# EAGLE design weather-sensor (EAGLE 9.6.1)
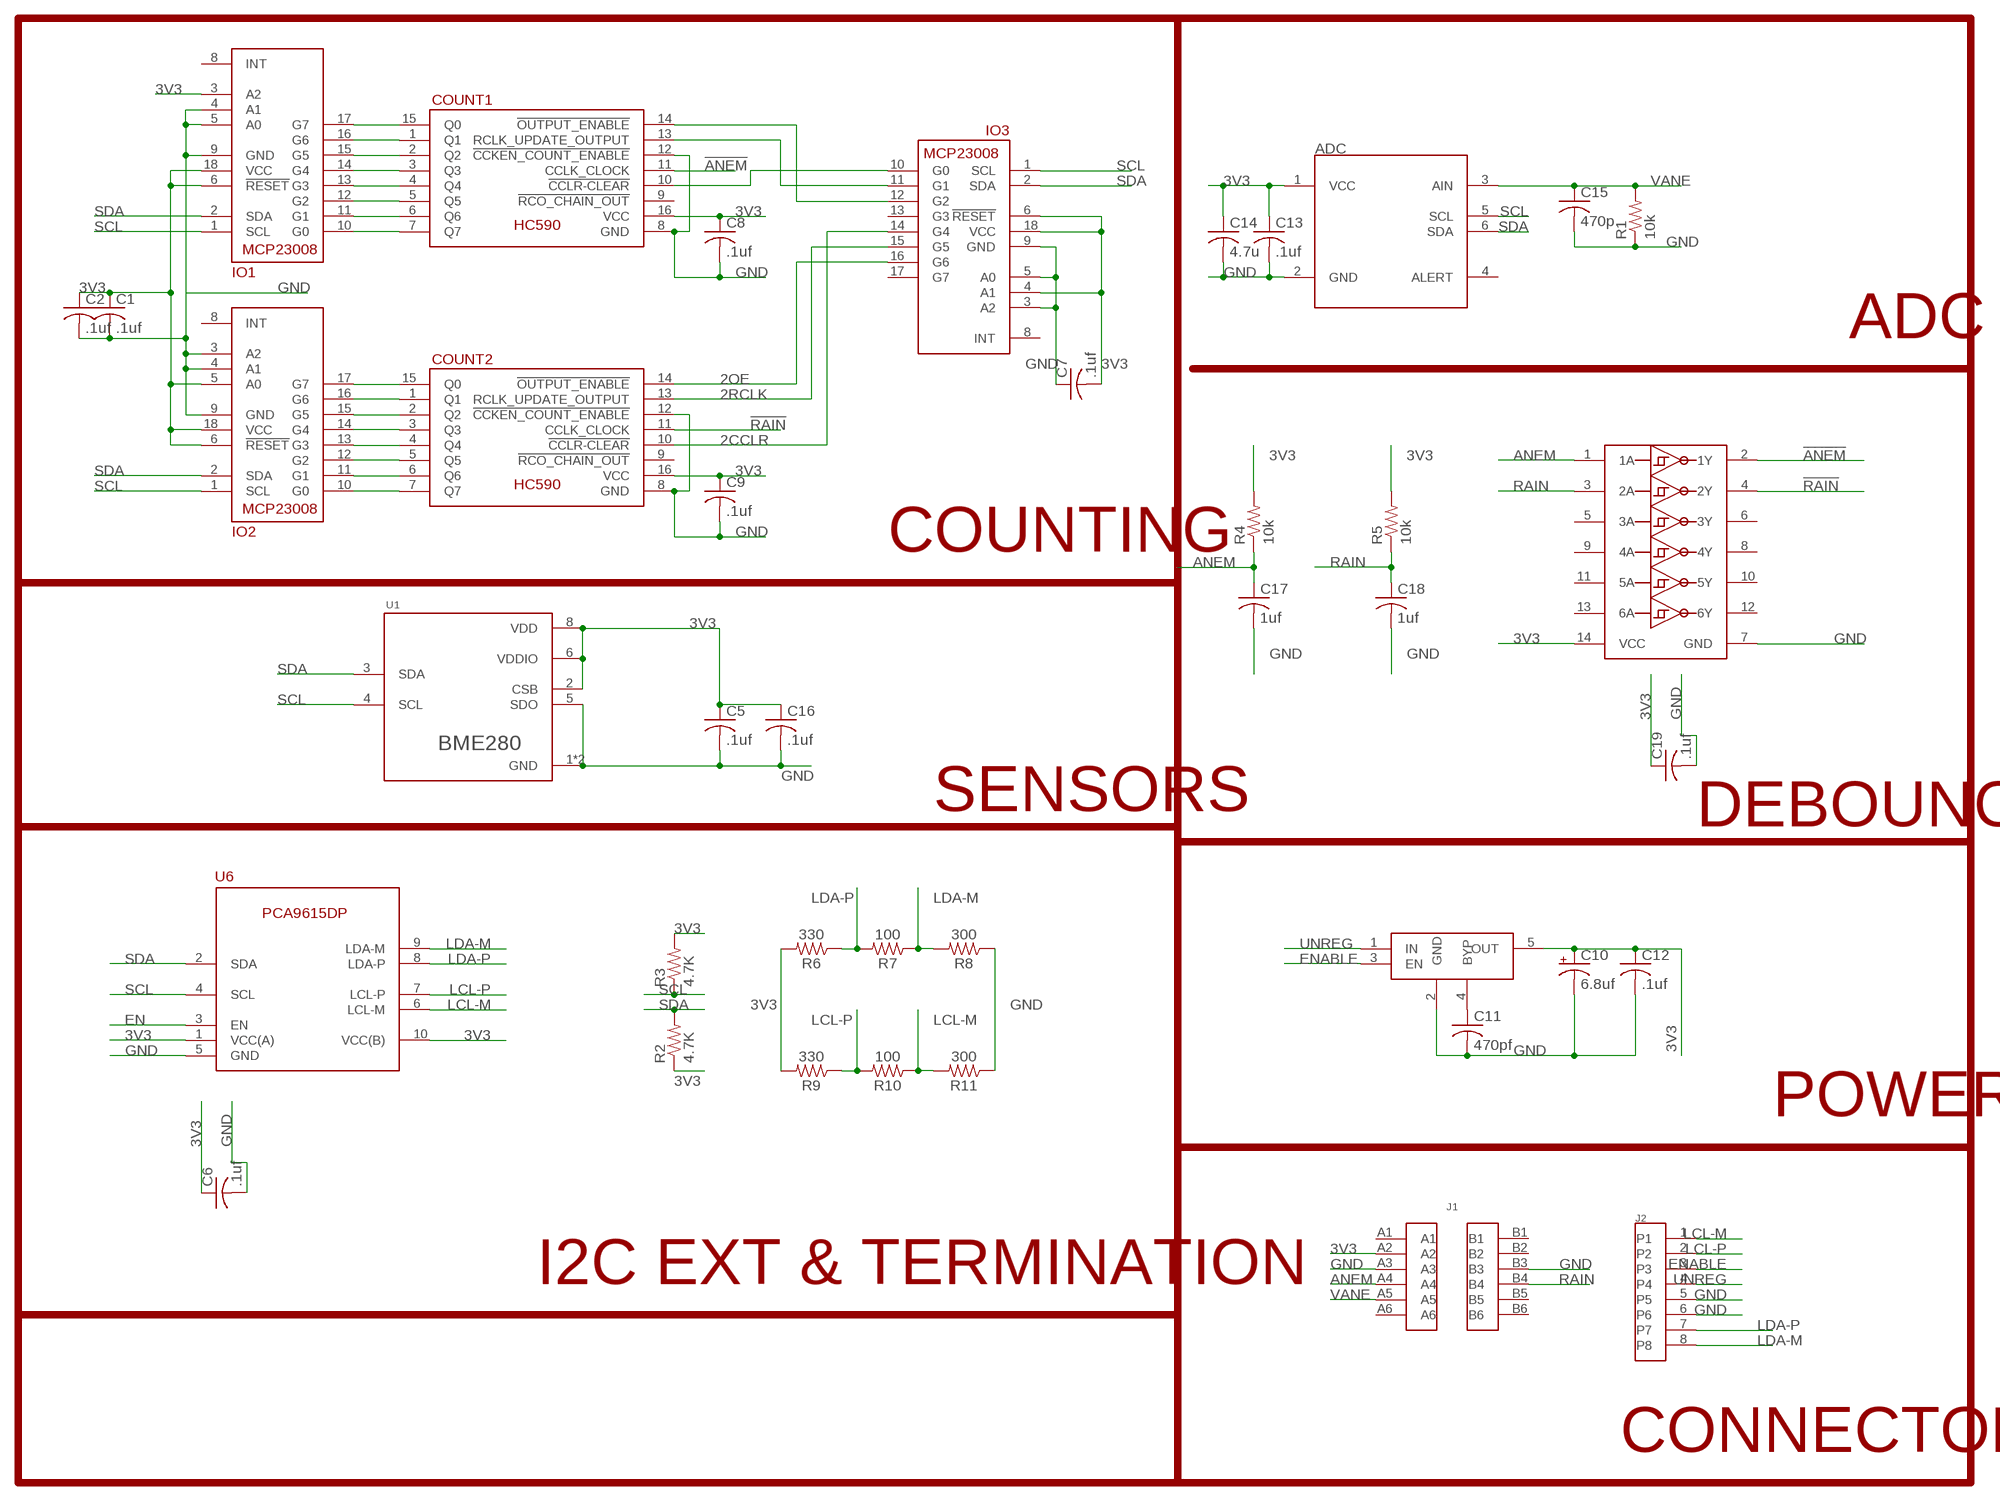
[diagram p0: schematic, sheet 1]

## Parts
ADC  ADC081C021SOT-DDC  [SOP95P280X110-6]
C1  .1uf  C-USC0603K  [C0603K]
C2  .1uf  C-USC0603K  [C0603K]
C5  .1uf  C-USC0603K  [C0603K]
C6  .1uf  C-USC0603K  [C0603K]
C7  .1uf  C-USC0603K  [C0603K]
C8  .1uf  C-USC0603K  [C0603K]
C9  .1uf  C-USC0603K  [C0603K]
C10  6.8uf  CPOL-USA/3216-18R  [A/3216-18R]
C11  470pf  C-USC0603K  [C0603K]
C12  .1uf  C-USC0603K  [C0603K]
C13  .1uf  C-USC0603K  [C0603K]
C14  4.7u  C-USC0603K  [C0603K]
C15  470p  C-USC0603K  [C0603K]
C16  .1uf  C-USC0603K  [C0603K]
C17  1uf  C-USC0603K  [C0603K]
C18  1uf  C-USC0603K  [C0603K]
C19  .1uf  C-USC0603K  [C0603K]
COUNT1  74HC590  [SOIC127P1050X265-16]
COUNT2  74HC590  [SOIC127P1050X265-16]
INVERTER  74HC14  [SOIC127P780X200-14]
IO1  MCP23008  [SOIC18-W]
IO2  MCP23008  [SOIC18-W]
IO3  MCP23008  [SOIC18-W]
J1  43841-0005  [43841-0005]
J2  95501-6889  [95501-6889]
R1  10k  R-US_R0603  [R0603]
R2  4.7K  R-US_R0603  [R0603]
R3  4.7K  R-US_R0603  [R0603]
R4  10k  R-US_R0603  [R0603]
R5  10k  R-US_R0603  [R0603]
R6  330  100KOHM-0603-1/10W-1%  [0603]
R7  100  100KOHM-0603-1/10W-1%  [0603]
R8  300  100KOHM-0603-1/10W-1%  [0603]
R9  330  100KOHM-0603-1/10W-1%  [0603]
R10  100  100KOHM-0603-1/10W-1%  [0603]
R11  300  100KOHM-0603-1/10W-1%  [0603]
U1  BME280  [BM280]
U5  MIC5219-3.3YM5-TR  [SOT95P280X145-5]
U6  PCA9615  [SOP50P490X110-10]

## Nets
2CCLR: COUNT2.10(!CCLR-CLEAR) IO3.14(G4)
2OE: COUNT2.14(!OUTPUT_ENABLE) IO3.16(G6)
2RCLK: COUNT2.13(RCLK_UPDATE_OUTPUT) IO3.15(G5)
3V3: ADC.1(VCC) C1.1 C2.1 C5.1 C6.1 C7.2 C8.1 C9.1 C10.+ C12.1 C13.1 C14.1 C16.1 C19.1 COUNT1.16(VCC) COUNT2.16(VCC) INVERTER.14(VCC) IO1.3(A2) IO1.6(!RESET) IO1.18(VCC) IO2.5(A0) IO2.6(!RESET) IO2.18(VCC) IO3.4(A1) IO3.6(!RESET) IO3.18(VCC) J1.A2 R2.1 R3.2 R4.2 R5.2 R6.2 R9.2 U1.2(CSB) U1.6(VDDIO) U1.8(VDD) U5.5(OUT) U6.1(VCC(A)) U6.10(VCC(B))
!ANEM: COUNT1.11(CCLK_CLOCK) INVERTER.2(1Y)
!RAIN: COUNT2.11(CCLK_CLOCK) INVERTER.4(2Y)
ANEM: C17.1 INVERTER.1(1A) J1.A4 R4.1
EN: U6.3(EN)
ENABLE: J2.3 U5.3(EN)
GND: ADC.2(GND) C1.2 C2.2 C5.2 C6.2 C7.1 C8.2 C9.2 C10.- C11.2 C12.2 C13.2 C14.2 C15.2 C16.2 C17.2 C18.2 C19.2 COUNT1.8(GND) COUNT1.12(!CCKEN_COUNT_ENABLE) COUNT2.8(GND) COUNT2.12(!CCKEN_COUNT_ENABLE) INVERTER.7(GND) IO1.4(A1) IO1.5(A0) IO1.9(GND) IO2.3(A2) IO2.4(A1) IO2.9(GND) IO3.3(A2) IO3.5(A0) IO3.9(GND) J1.A3 J1.B3 J2.5 J2.6 R1.1 R8.1 R11.1 U1.1(GND) U1.5(SDO) U1.7(GND) U5.2(GND) U6.5(GND)
LCL-M: J2.1 R10.1 R11.2 U6.6(LCL-M)
LCL-P: J2.2 R9.1 R10.2 U6.7(LCL-P)
LDA-M: J2.8 R7.1 R8.2 U6.9(LDA-M)
LDA-P: J2.7 R6.1 R7.2 U6.8(LDA-P)
N$1: COUNT2.15(Q0) IO2.17(G7)
N$2: COUNT2.1(Q1) IO2.16(G6)
N$3: COUNT2.2(Q2) IO2.15(G5)
N$4: COUNT2.3(Q3) IO2.14(G4)
N$5: COUNT2.4(Q4) IO2.13(G3)
N$6: COUNT2.5(Q5) IO2.12(G2)
N$7: COUNT2.6(Q6) IO2.11(G1)
N$8: COUNT2.7(Q7) IO2.10(G0)
N$9: COUNT1.15(Q0) IO1.17(G7)
N$10: COUNT1.1(Q1) IO1.16(G6)
N$12: COUNT1.2(Q2) IO1.15(G5)
N$13: COUNT1.3(Q3) IO1.14(G4)
N$14: COUNT1.4(Q4) IO1.13(G3)
N$15: COUNT1.5(Q5) IO1.12(G2)
N$16: COUNT1.6(Q6) IO1.11(G1)
N$17: COUNT1.7(Q7) IO1.10(G0)
N$18: COUNT1.14(!OUTPUT_ENABLE) IO3.12(G2)
N$19: COUNT1.13(RCLK_UPDATE_OUTPUT) IO3.11(G1)
N$20: COUNT1.10(!CCLR-CLEAR) IO3.10(G0)
N$23: C11.1 U5.4(BYP)
RAIN: C18.1 INVERTER.3(2A) J1.B4 R5.1
SCL: ADC.5(SCL) IO1.1(SCL) IO2.1(SCL) IO3.1(SCL) R3.1 U1.4(SCL) U6.4(SCL)
SDA: ADC.6(SDA) IO1.2(SDA) IO2.2(SDA) IO3.2(SDA) R2.2 U1.3(SDA) U6.2(SDA)
UNREG: J2.4 U5.1(IN)
VANE: ADC.3(AIN) C15.1 J1.A5 R1.2
Unconnected: ADC.4(ALERT) COUNT1.9(!RCO_CHAIN_OUT) COUNT2.9(!RCO_CHAIN_OUT) INVERTER.5(3A) INVERTER.6(3Y) INVERTER.8(4Y) INVERTER.9(4A) INVERTER.10(5Y) INVERTER.11(5A) INVERTER.12(6Y) INVERTER.13(6A) IO1.8(INT) IO2.8(INT) IO3.8(INT) IO3.13(G3) IO3.17(G7) J1.A1 J1.A6 J1.B1 J1.B2 J1.B5 J1.B6

## Notes on the sheet
- ADC
- COUNTING
- SENSORS | DEBOUNCE
- POWER
- I2C EXT & TERMINATION
- CONNECTORS

## Library data of the parts
ADC = Conservify:ADC081C021: 8-Bit ADC with Altert
C1 C2 C5-C9 C11-C19 = rcl:C-US: CAPACITOR, American symbol; SPICEPREFIX: C
C10 = rcl:CPOL-US: POLARIZED CAPACITOR, American symbol; SPICEPREFIX: C
COUNT1 COUNT2 = Conservify:74HC590
INVERTER = Conservify:74HC14
IO1-IO3 = Conservify:MCP23008
J1 = Conservify:43841-0005
J2 = Conservify:95501-6889: Molex RJ-45 Connector
R1-R5 = rcl:R-US_: RESISTOR, American symbol; SPICEPREFIX: R
R6-R11 = SparkFun-Resistors:100KOHM: 100kΩ resistor A resistor is a passive two-terminal electrical component that implements electrical resistance as a circuit element. Resistors act to reduce current flow, and, at the same time, act to lower voltage levels within circuits. - Wikipedia; PROD_ID: RES-07828; VALUE: 100k
U1 = Conservify:BME280
U5 = Conservify:MIC5219-3.3YM5-TR
U6 = Conservify:PCA9615

## Board
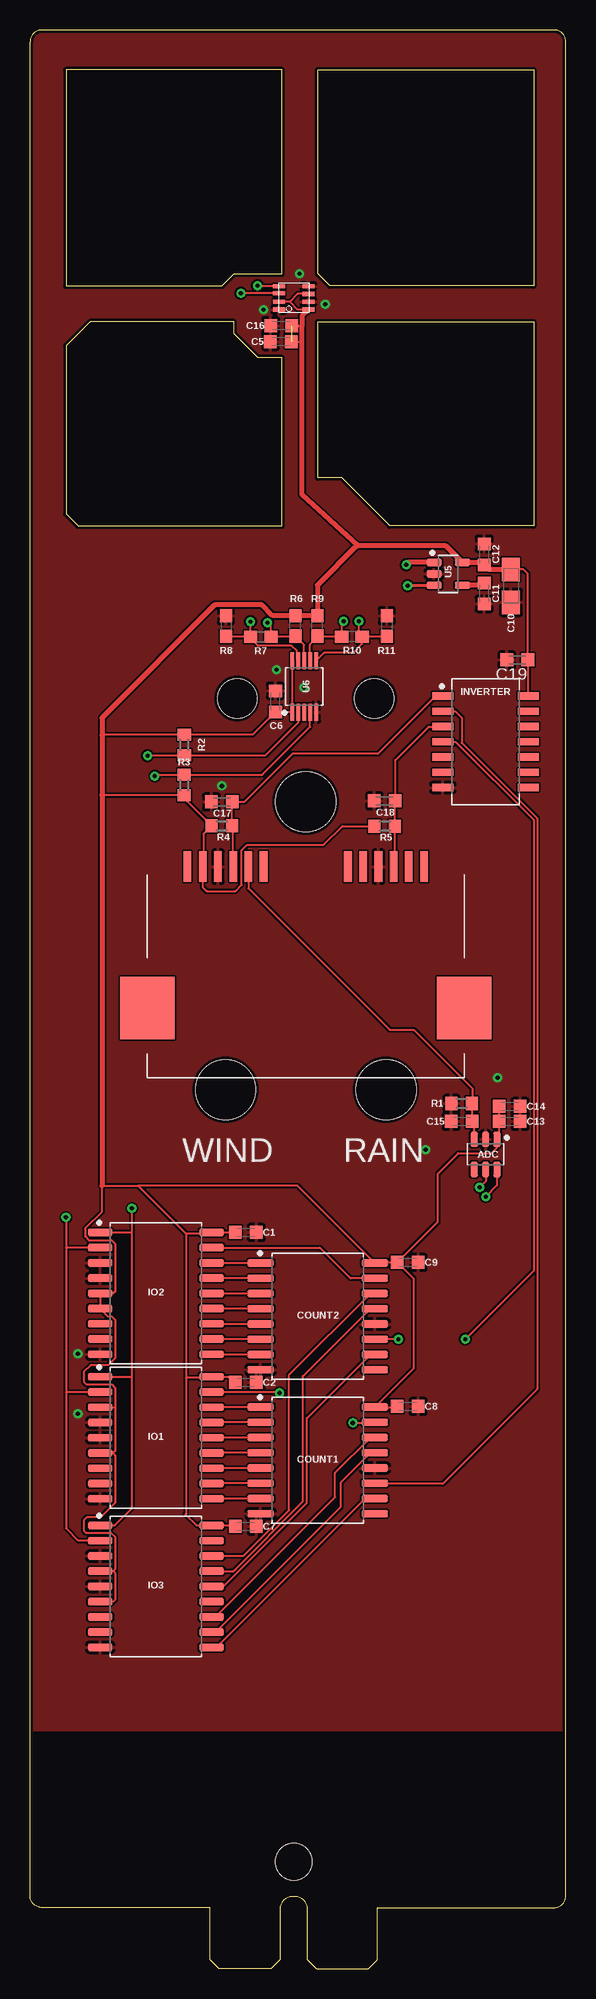
[diagram p1: board, top side]
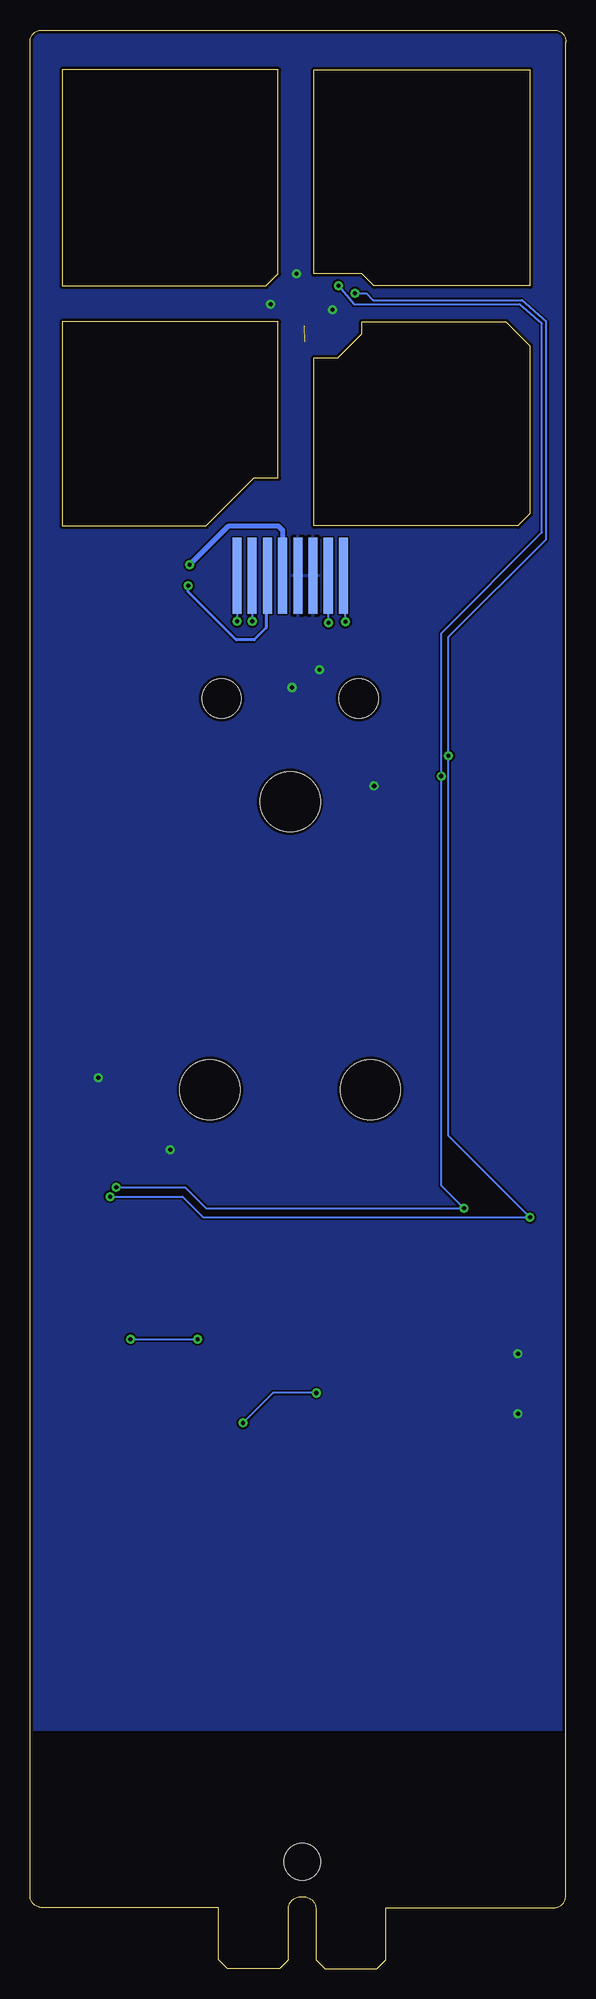
[diagram p2: board, bottom side, seen from below]

Size 44.7 x 161.54 mm. Coordinates in mm from the lower left corner, seen from the top.
Outline: 28.98,5.08 43.7,5.08 arc90 44.7,6.08 44.7,160.54 arc90 43.7,161.54 1,161.54 arc90 0,160.54 0,6.08 arc90 1,5.08 15.02,5.08 15.02,0.75 15.77,0 20.11,0 20.86,0.75 20.86,4.98 arc-90 21.86,5.98 22.14,5.98 arc-90 23.14,4.98 23.14,0.75 23.89,0 28.23,0 28.98,0.75 28.98,5.08
Outline: 24,137.22 42,137.22 42,120.22 30,120.22 26,124.22 24,124.22 24,137.22
Outline: 21,134.22 19,134.22 17,136.22 17,137.22 5,137.22 3,135.22 3,121.22 4,120.22 21,120.22 21,134.22
Outline: 17,141.22 21,141.22 21,158.22 3,158.22 3,140.22 16,140.22 17,141.22
Outline: 24,141.22 24,158.22 42,158.22 42,140.22 25,140.22 24,141.22
Copper layers (1*16): Top 0.035mm / dielectric 1.5mm / Bottom 0.035mm
Design rules "default *": minimum track width 6mil, minimum drill 0.35mm, track to track 6mil, track to pad 6mil, pad to pad 6mil, via to via 6mil, smd to smd 6mil, copper to edge 10mil, drill to drill 6mil, minimum pad ring 10mil, minimum via ring 8mil, stop-mask expansion 4mil, vias tented up to drill 0.35mm, thermal gap 10mil
Holes 5 mm at 23,97.22 16.3,73.22 29.7,73.22
Holes 3.05 mm at 22,8.89

### Footprints (pad centres in the part's own frame; a part is rotated, then mirrored left to right if it is on the bottom)
SOP95P280X110-6 = smd 1.25 x 0.602: 1 -1.256,0.95; 2 -1.256,0; 3 -1.256,-0.95; 4 1.256,-0.95; 5 1.256,0; 6 1.256,0.95
C0603K = smd 1.05 x 1.08: 1 -0.875,0; 2 0.875,0
A/3216-18R = smd 1.95 x 1.5: + 1.375,0; - -1.375,0
SOIC127P1050X265-16 = smd 2.187 x 0.602: 1 -4.76,4.445; 2 -4.76,3.175; 3 -4.76,1.905; 4 -4.76,0.635; 5 -4.76,-0.635; 6 -4.76,-1.905; 7 -4.76,-3.175; 8 -4.76,-4.445; 9 4.76,-4.445; 10 4.76,-3.175; 11 4.76,-1.905; 12 4.76,-0.635; 13 4.76,0.635; 14 4.76,1.905; 15 4.76,3.175; 16 4.76,4.445
SOIC127P780X200-14 = smd 1.774 x 0.605: 1 -3.567,3.81; 2 -3.567,2.54; 3 -3.567,1.27; 4 -3.567,0; 5 -3.567,-1.27; 6 -3.567,-2.54; 7 -3.567,-3.81; 8 3.567,-3.81; 9 3.567,-2.54; 10 3.567,-1.27; 11 3.567,0; 12 3.567,1.27; 13 3.567,2.54; 14 3.567,3.81
SOIC18-W = smd 2.052 x 0.602: 1 -4.654,5.08; 2 -4.654,3.81; 3 -4.654,2.54; 4 -4.654,1.27; 5 -4.654,0; 6 -4.654,-1.27; 7 -4.654,-2.54; 8 -4.654,-3.81; 9 -4.654,-5.08; 10 4.654,-5.08; 11 4.654,-3.81; 12 4.654,-2.54; 13 4.654,-1.27; 14 4.654,0; 15 4.654,1.27; 16 4.654,2.54; 17 4.654,3.81; 18 4.654,5.08
43841-0005 = smd 0.63 x 2.54: A1 -9.87,17.58; A2 -8.6,17.58; A3 -7.33,17.58; A4 -6.06,17.58; A5 -4.79,17.58; A6 -3.52,17.58; B1 3.52,17.58; B2 4.79,17.58; B3 6.06,17.58; B4 7.33,17.58; B5 8.6,17.58; B6 9.87,17.58 | smd 4.52 x 5.21: PAD1 -13.21,5.785; PAD2 13.21,5.785
95501-6889 = smd 0.76 x 6.35: 1 -4.445,10.225; 2 -3.175,10.225; 3 -1.905,10.225; 4 -0.635,10.225; 5 0.635,10.225; 6 1.905,10.225; 7 3.175,10.225; 8 4.445,10.225 | hole 3.25: -5.715,0; 5.715,0
R0603 = smd 1 x 1.1: 1 -0.85,0; 2 0.85,0
0603 = smd 1.1 x 1: 1 -0.85,0; 2 0.85,0
BM280 = smd 1 x 0.35: 1 1.225,0.975; 2 1.225,0.325; 3 1.225,-0.375; 4 1.225,-0.975; 5 -1.225,-0.975; 6 -1.225,-0.325; 7 -1.225,0.325; 8 -1.225,0.975
SOT95P280X145-5 = smd 1.262 x 0.609: 1 -1.175,0.95; 2 -1.175,0; 3 -1.175,-0.95; 4 1.175,-0.95; 5 1.175,0.95
SOP50P490X110-10 = smd 1.438 x 0.297: 1 -2.145,1; 2 -2.145,0.5; 3 -2.145,0; 4 -2.145,-0.5; 5 -2.145,-1; 6 2.145,-1; 7 2.145,-0.5; 8 2.145,0; 9 2.145,0.5; 10 2.145,1

### Placement (x,y rotation side)
ADC  38,67.84 270 top
C1  18,61.34 0 top
C2  18,48.84 0 top
C5  20.92,135.58 180 top
C6  20.46,105.59 90 top
C7  18,36.84 180 top
C8  31.5,46.84 0 top
C9  31.5,58.84 0 top
C10  40.12,115.22 90 top
C11  37.88,114.6 270 top
C12  37.88,117.85 90 top
C13  40,70.59 0 top
C14  40,71.84 0 top
C15  36,70.59 180 top
C16  20.95,136.91 180 top
C17  16,97.22 180 top
C18  29.59,97.3 180 top
C19  40.65,109.06 180 top
COUNT1  24,42.34 0 top
COUNT2  24,54.34 0 top
INVERTER  38,102.22 0 top
IO1  10.5,44.23 0 top
IO2  10.5,56.27 0 top
IO3  10.5,31.84 0 top
J1  23,74.24 0 top
J2  23,105.83 0 bottom
R1  36,72.09 0 top
R2  12.87,101.97 270 top
R3  12.86,98.61 270 top
R4  16,95.22 180 top
R5  29.59,95.2 180 top
R6  22.13,111.89 90 top
R7  19.25,110.97 0 top
R8  16.35,111.88 270 top
R9  23.97,111.89 90 top
R10  26.86,111 180 top
R11  29.75,111.88 270 top
U1  22,139.22 180 top
U5  34.88,116.22 0 top
U6  22.87,106.84 90 top

### Tracks (layer width: path | path; a pad name or v marks a point on that pad's centre or on a via)
2CCLR
  Top 0.152: COUNT2.10 28.38,51.17 23.09,45.88 23.09,38.81 16.12,31.84 IO3.14
2OE
  Top 0.152: COUNT2.14 28.38,56.25 21.62,49.48 21.62,38.2 17.8,34.38 IO3.16
2RCLK
  Top 0.152: COUNT2.13 28.38,54.98 22.77,49.37 22.77,38.92 16.96,33.11 IO3.15
3V3  (1 unrouted)
  Top 0.152: 6,102.74 6.08,102.82 R2.1 18.57,102.82 C6.1 20.48,104.7 U6.1 U6.10 | 6,97.79 6.03,97.76 R3.2 12.86,97.51 R4.2 14.48,94.55 14.48,91.9 J1.A2 14.4,90.12 14.73,89.79 17.14,89.79 17.67,90.31 17.67,93.19 18.11,93.63 24.49,93.63 26.06,95.2 R5.2 29.08,94.86 | 7.1,46.74 7.1,48.37 6.8,48.67 4.71,48.67 4.49,48.89 4.49,49.74 5.05,50.29 6.53,50.29 7.1,50.86 7.1,54.05 6.8,54.36 6.49,54.36 IO2.6 IO2.5 6.96,56.27 7.1,56.41 7.1,60.4 6.8,60.7 4.91,60.7 4.59,61.02 4.59,61.67 6,63.08 6,65.22 9,65.22 | 7.1,46.74 7.1,43.11 6.96,42.96 IO1.6 6.91,42.96 7.1,42.77 7.1,38.83 5.88,37.6 4.75,37.6 4.49,37.35 4.49,36.5 4.66,36.33 6.75,36.33 7.1,35.98 7.1,33.26 6.96,33.11 | 6.96,33.11 IO3.4 | 6.96,33.11 7.1,32.97 7.1,30.72 6.96,30.57 IO3.6 | 9,65.22 13,61.22 | 13,61.22 13,49.22 | 13,49.22 13,37.89 12.95,37.85 13.88,36.92 IO3.18 17.05,36.92 C7.2 | 13,49.22 15.06,49.22 IO1.18 16.66,49.31 C2.1 | 13,61.22 15.03,61.22 IO2.18 C1.1 | C9.1 28.82,58.84 COUNT2.16 22.32,65.22 9,65.22 | C8.1 30.57,46.79 COUNT1.16 32,50.03 32,57.47 C9.1 | C9.1 34,62.22 34,66.22 35.72,67.94 38.48,67.94 38.95,68.41 ADC.1 39.12,69.28 C13.1 C14.1 | INVERTER.14 41.57,109.01 C19.1 41.52,116.21 41.13,116.6 40,116.6 | IO1.3 7.06,46.77 7.1,46.74 | U1.6 22.33,139.55 21.68,138.9 | 21.68,138.9 U1.2 | U1.8 22.33,138.25 21.68,138.9 | C16.1 22.7,136.91 | C5.1 22.64,135.58
  Top 0.406: C10.+ 40,116.6 38.26,116.6 C12.1 37.68,117.17 U5.5 34.68,118.55 27.34,118.55 | 27.34,118.55 27.23,118.55 23.97,115.29 R9.2 R6.2 20.25,112.74 19.35,113.64 15.41,113.64 6,104.22 6,102.74 6,97.79 6,65.22 | 27.34,118.55 22.7,122.84 22.7,136.91 22.7,137.73 U1.8
!ANEM
  Top 0.152: INVERTER.2 35.46,104.76 36,104.22 36,102.15 42.3,95.84 42.3,48.27 34.42,40.39 28.81,40.39 COUNT1.11
!RAIN  (via drill 0.35)
  Top 0.152: INVERTER.4 35.49,102.22 42,95.72 42,58.13 v36.32,52.45 | v30.73,52.45 30.72,52.44 COUNT2.11
  Bottom 0.152: v36.32,52.45 v30.73,52.45
ANEM
  Top 0.152: J1.A4 16.94,95.13 R4.1 16.85,97.2 C17.1 17.88,97.22 21.88,101.22 29,101.22 34,106.22 34.24,106.22 INVERTER.1
ENABLE  (via drill 0.35)
  Top 0.254: v31.5,115.22 31.55,115.27 U5.3
  Bottom 0.254: J2.3 25,115.96 25,111.72 26,110.72 27.5,110.72 31.5,114.72 v31.5,115.22
GND  (via drill 0.35)
  other vias: 4,51.22 4,46.22 39,74.22 33,68.22 16,98.55 22.86,106.75 20.56,108.23 22.48,141.22 19.48,138.22 24.62,138.68
  pour Top: -0.5,162.69 -0.5,19.84 45,19.84 45,162.69
  pour Bottom: -0.5,162.69 -0.5,19.84 45,19.84 45,162.69
LCL-M  (via drill 0.35)
  Top 0.152: R10.1 29.71,111 R11.2 | R10.1 27.43,111.27 v27.43,112.27 | U6.6 24.56,109.67 27,109.67 27.71,110.38 R10.1
  Bottom 0.152: J2.1 27.45,112.28 v27.43,112.27
LCL-P  (via drill 0.35)
  Top 0.152: 24.02,111 R10.2 26.01,112.11 v26.16,112.27 | 24.02,111 R9.1 | U6.7 23.37,110.36 24.02,111
  Bottom 0.152: v26.16,112.27 26.16,116.05 J2.2
LDA-M  (via drill 0.35)
  Top 0.152: R7.1 16.42,110.97 R8.2 | R7.1 18.39,110.83 19,110.22 21.83,110.22 22.25,109.8 22.25,109.11 U6.9 | R7.1 v18.39,112.22
  Bottom 0.152: v18.39,112.22 18.39,115.9 J2.8
LDA-P  (via drill 0.35)
  Top 0.152: v19.81,112.14 20.09,111.86 R7.2 22.05,110.97 R6.1 22.87,110.3 U6.8
  Bottom 0.152: v19.81,112.14 J2.7
N$1
  Top 0.152: COUNT2.15 26.73,57.52 24.18,60.08 IO2.17
N$2
  Top 0.152: IO2.16 15.17,58.79 COUNT2.1
N$3
  Top 0.152: IO2.15 15.17,57.52 COUNT2.2
N$4
  Top 0.152: IO2.14 15.17,56.25 COUNT2.3
N$5
  Top 0.152: IO2.13 15.17,54.98 COUNT2.4
N$6
  Top 0.152: IO2.12 15.17,53.71 COUNT2.5
N$7
  Top 0.152: IO2.11 15.17,52.44 COUNT2.6
N$8
  Top 0.152: IO2.10 15.17,51.17 COUNT2.7
N$9  (via drill 0.35)
  Top 0.152: v20.82,47.96 20.74,48.04 IO1.17 | v26.92,45.47 28.71,45.47 COUNT1.15
  Bottom 0.152: v20.82,47.96 24.43,47.96 v26.92,45.47
N$10
  Top 0.152: IO1.16 15.17,46.79 COUNT1.1
N$12
  Top 0.152: IO1.15 15.17,45.52 COUNT1.2
N$13
  Top 0.152: IO1.14 15.17,44.25 COUNT1.3
N$14
  Top 0.152: IO1.13 15.17,42.98 COUNT1.4
N$15
  Top 0.152: IO1.12 15.17,41.71 COUNT1.5
N$16
  Top 0.152: IO1.11 15.17,40.44 COUNT1.6
N$17
  Top 0.152: IO1.10 15.17,39.17 COUNT1.7
N$18
  Top 0.152: COUNT1.14 28.38,44.25 25.44,41.31 25.44,39.28 15.46,29.3 IO3.12
N$19
  Top 0.152: COUNT1.13 28.38,42.98 25.93,40.52 25.93,38.5 15.46,28.03 IO3.11
N$20
  Top 0.152: COUNT1.10 27.95,39.17 15.55,26.76 IO3.10
N$23
  Top 0.406: C11.1 37.68,115.27 U5.4
RAIN
  Top 0.152: J1.B4 30.44,91.94 R5.1 30.44,97.27 C18.1 30.47,100.69 33.27,103.49 INVERTER.3
SCL  (via drill 0.35)
  Top 0.152: IO3.1 7.08,36.92 8.5,38.34 8.5,49.34 | 8.5,49.34 8.5,61.34 | 8.5,61.34 v8.5,63.34 | IO1.1 8.47,49.31 8.5,49.34 | IO2.1 8.5,61.34 | ADC.5 38,65.59 v37.5,65.09 | U6.4 23.37,103.48 19.36,99.46 R3.1 10.5,99.46 v10.41,99.37 | U1.4 19.02,140.2 v18.98,140.24
  Bottom 0.152: v37.5,65.09 31.75,65.09 30,63.34 v8.5,63.34 10.4,65.24 v10.4,99.37 v10.41,99.37 10.41,111.27 2,119.67 2,137.07 3.87,138.69 17.7,138.69 v18.98,140.24
SDA  (via drill 0.35)
  Top 0.152: v3,62.59 3,60.07 | 3,60.07 3,48.01 | 3,48.01 3,36.69 4.03,35.65 IO3.2 | IO2.2 3,60.08 3,60.07 | IO1.2 3.04,48.04 3,48.01 | ADC.6 38.95,65.26 v38.02,64.33 | U6.2 22.38,103.84 19.66,101.12 R2.2 9.85,101.12 v9.8,101.07 | U1.3 v17.59,139.6
  Bottom 0.152: v38.02,64.33 31.98,64.33 30.25,62.59 v3,62.59 9.8,69.39 v9.8,101.07 9.8,110.97 1.65,119.12 1.65,137.25 3.7,139.04 16.09,139.04 16.64,139.6 v17.59,139.6
UNREG  (via drill 0.35)
  Top 0.406: U5.1 31.58,117.17 v31.38,116.97
  Bottom 0.406: v31.38,116.97 28.13,120.22 24,120.22 23.64,119.86 23.64,116.22 J2.4
VANE
  Top 0.152: ADC.3 37.05,70.42 C15.1 36.88,72.07 | 36.88,72.07 R1.2 | J1.A5 18.21,90.01 30,78.22 32,78.22 36.88,73.35 36.88,72.07

### Text on the board
tPlace: WIND | RAIN